# Altium schematic sheet 走线图2.SchDoc
size A3; PageSetup: Record=PageOptions|CenterHorizontal=True|CenterVertical=True|PrintScale=0.71|XCorrection=1.00|YCorrection=1.00|PrintKind=1|BorderSize=5000000|LeftOffset=0|BottomOffset=0|Orientation=2|PaperLength=1000|PaperWidth=1000|Scale=100|PaperSource=260|PrintQuality=600|MediaType=1|DitherType=10|PaperKind=A4|PrintScaleMode=1
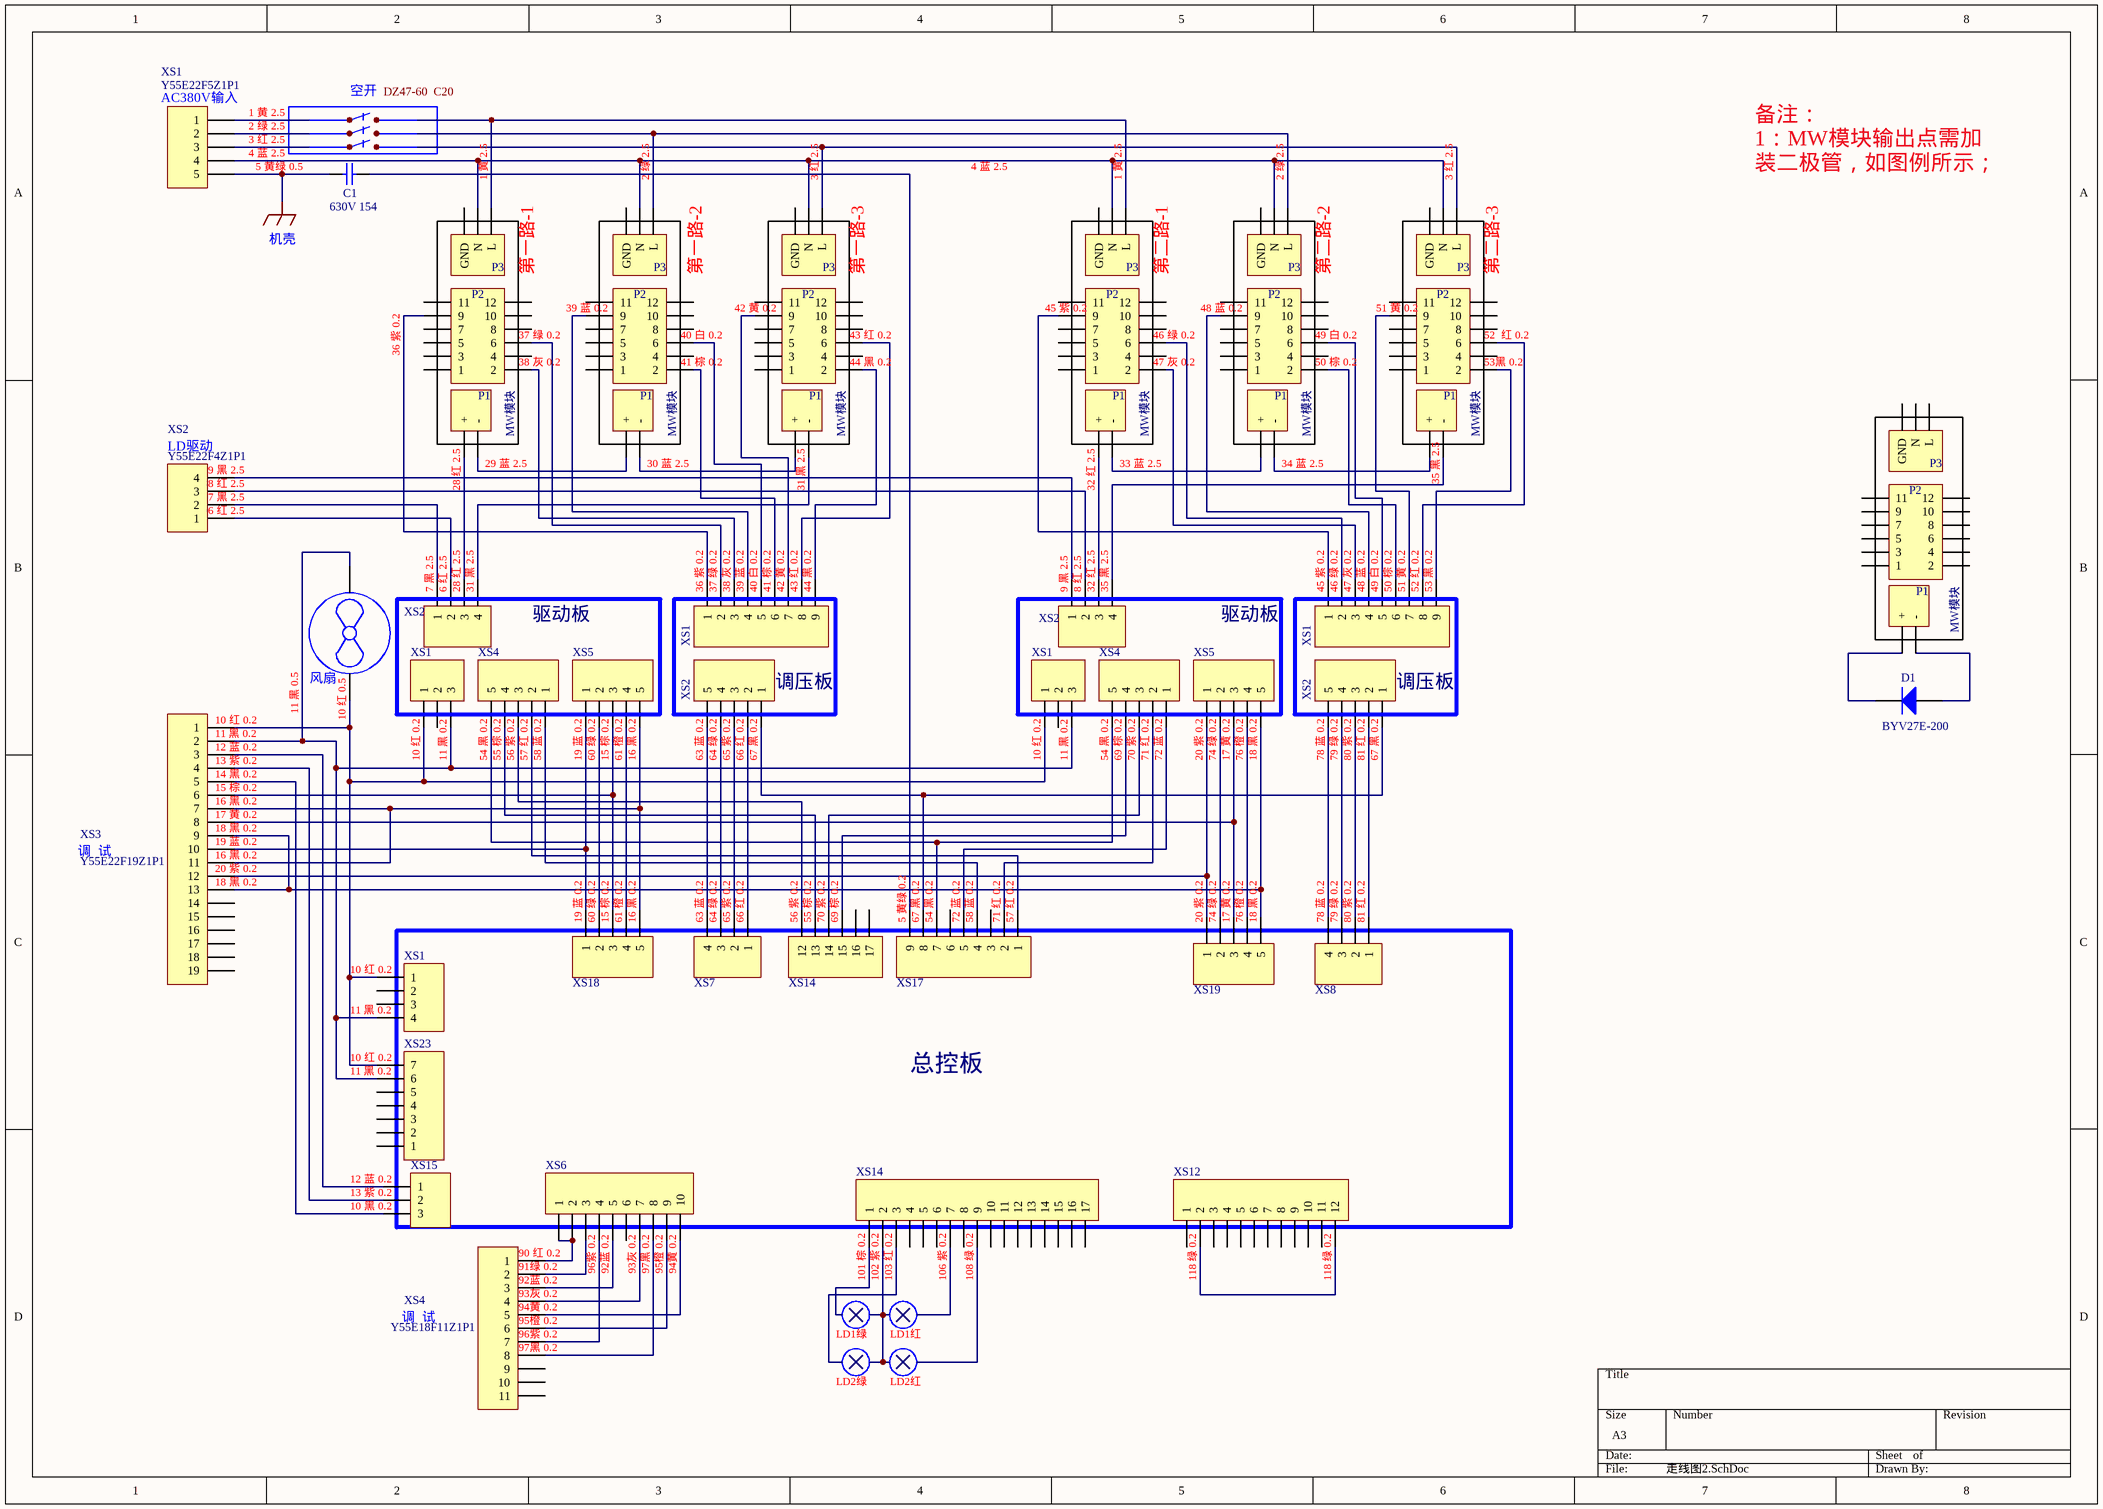
[diagram p0: 走线图2.SchDoc]

## Parts
(Parts that share a designator on the sheet are numbered #1, #2 ... from top to bottom, then left to right.)
?  (no value)
C1  value 630V 154  [RAD-0.3]  (hidden comment: Cap)
D1  BYV27E-200  [DIO18.84-9.6x5.6]
P1#1  Header 2  [HDR1X2]  (value not drawn)
P1#2  Header 2  [HDR1X2]  (value not drawn)
P1#3  Header 2  [HDR1X2]  (value not drawn)
P1#4  Header 2  [HDR1X2]  (value not drawn)
P1#5  Header 2  [HDR1X2]  (value not drawn)
P1#6  Header 2  [HDR1X2]  (value not drawn)
P1#7  Header 2  [HDR1X2]  (value not drawn)
P2#1  Header 6X2H  [HDR2X6H]  (value not drawn)
P2#2  Header 6X2H  [HDR2X6H]  (value not drawn)
P2#3  Header 6X2H  [HDR2X6H]  (value not drawn)
P2#4  Header 6X2H  [HDR2X6H]  (value not drawn)
P2#5  Header 6X2H  [HDR2X6H]  (value not drawn)
P2#6  Header 6X2H  [HDR2X6H]  (value not drawn)
P2#7  Header 6X2H  [HDR2X6H]  (value not drawn)
P3#1  Header 3  [HDR1X3]  (value not drawn)
P3#2  Header 3  [HDR1X3]  (value not drawn)
P3#3  Header 3  [HDR1X3]  (value not drawn)
P3#4  Header 3  [HDR1X3]  (value not drawn)
P3#5  Header 3  [HDR1X3]  (value not drawn)
P3#6  Header 3  [HDR1X3]  (value not drawn)
P3#7  Header 3  [HDR1X3]  (value not drawn)
XS1#1  Y55E22F5Z1P1  [HDR1X5]
XS1#2  Header 9  [HDR1X9]  (value not drawn)
XS1#3  Header 9  [HDR1X9]  (value not drawn)
XS1#4  Header 3  [HDR1X3]  (value not drawn)
XS1#5  Header 3  [HDR1X3]  (value not drawn)
XS1#6  Header 4  [HDR1X4]  (value not drawn)
XS2#1  Y55E22F4Z1P1  [HDR1X4]
XS2#2  Header 4  [HDR1X4]  (value not drawn)
XS2#3  Header 4  [HDR1X4]  (value not drawn)
XS2#4  Header 5  [HDR1X5]  (value not drawn)
XS2#5  Header 5  [HDR1X5]  (value not drawn)
XS3  Y55E22F19Z1P1  [HDR1X19]
XS4#1  Header 5  [HDR1X5]  (value not drawn)
XS4#2  Header 5  [HDR1X5]  (value not drawn)
XS4#3  Y55E18F11Z1P1  [HDR1X11]
XS5#1  Header 5  [HDR1X5]  (value not drawn)
XS5#2  Header 5  [HDR1X5]  (value not drawn)
XS6  Header 10  [HDR1X10]  (value not drawn)
XS7  Header 4  [HDR1X4]  (value not drawn)
XS8  Header 4  [HDR1X4]  (value not drawn)
XS12  Header 12  [HDR1X12]  (value not drawn)
XS14#1  Header 6  [HDR1X6]  (value not drawn)
XS14#2  Header 17  [HDR1X17]  (value not drawn)
XS15  Header 3  [HDR1X3]  (value not drawn)
XS17  Header 9  [HDR1X9]  (value not drawn)
XS18  Header 5  [HDR1X5]  (value not drawn)
XS19  Header 5  [HDR1X5]  (value not drawn)
XS23  Header 7  [HDR1X7]  (value not drawn)

## Blocks framed on the sheet
驱动板: XS1#4 XS2#2 XS4#1 XS5#1
调压板: XS1#2 XS2#4
驱动板: XS1#5 XS2#3 XS4#2 XS5#2
调压板: XS1#3 XS2#5
总控板: XS1#6 XS6-XS8 XS12 XS14#1 XS14#2 XS15 XS17-XS19 XS23

## Nets
VSS: C1.2 XS1#1.5
Net?_9: ?.9 XS1#4.3 XS1#5.3 XS1#6.4 XS3.2 XS23.6
Net?_10: ?.10 XS1#4.1 XS1#5.1 XS1#6.1 XS3.1 XS23.7
NetC1_1: C1.1 XS17.9
NetD1_1: D1.1(A) P1#7.2(-)
NetD1_2: D1.2(K) P1#7.1(+)
NetP1#1_1: P1#1.1(+) XS2#2.3
NetP1#1_2: P1#1.2(-) P1#2.1(+)
NetP1#2_2: P1#2.2(-) P1#3.1(+)
NetP1#3_2: P1#3.2(-) XS2#2.4
NetP1#4_1: P1#4.1(+) XS2#3.3
NetP1#4_2: P1#4.2(-) P1#5.1(+)
NetP1#5_2: P1#5.2(-) P1#6.1(+)
NetP1#6_2: P1#6.2(-) XS2#3.4
NetP2#1_2: P2#1.2 XS1#2.3
NetP2#1_6: P2#1.6 XS1#2.2
NetP2#1_9: P2#1.9 XS1#2.1
NetP2#2_2: P2#2.2 XS1#2.6
NetP2#2_6: P2#2.6 XS1#2.5
NetP2#2_9: P2#2.9 XS1#2.4
NetP2#3_2: P2#3.2 XS1#2.9
NetP2#3_6: P2#3.6 XS1#2.8
NetP2#3_9: P2#3.9 XS1#2.7
NetP2#4_2: P2#4.2 XS1#3.3
NetP2#4_6: P2#4.6 XS1#3.2
NetP2#4_9: P2#4.9 XS1#3.1
NetP2#5_2: P2#5.2 XS1#3.6
NetP2#5_6: P2#5.6 XS1#3.5
NetP2#5_9: P2#5.9 XS1#3.4
NetP2#6_2: P2#6.2 XS1#3.9
NetP2#6_6: P2#6.6 XS1#3.8
NetP2#6_9: P2#6.9 XS1#3.7
NetP3#1_1: P3#1.1(L) P3#4.1(L)
NetP3#1_2: P3#1.2(N) P3#2.2(N) P3#3.2(N) P3#4.2(N) P3#5.2(N) P3#6.2(N) XS1#1.4
NetP3#2_1: P3#2.1(L) P3#5.1(L)
NetP3#3_1: P3#3.1(L) P3#6.1(L)
NetXS2#1_1: XS2#1.1 XS2#2.2
NetXS2#1_2: XS2#1.2 XS2#2.1
NetXS2#1_3: XS2#1.3 XS2#3.2
NetXS2#1_4: XS2#1.4 XS2#3.1
NetXS2#4_1: XS2#4.1 XS2#5.1 XS17.8
NetXS2#4_2: XS2#4.2 XS7.1
NetXS2#4_3: XS2#4.3 XS7.2
NetXS2#4_4: XS2#4.4 XS7.3
NetXS2#4_5: XS2#4.5 XS7.4
NetXS2#5_2: XS2#5.2 XS8.1
NetXS2#5_3: XS2#5.3 XS8.2
NetXS2#5_4: XS2#5.4 XS8.3
NetXS2#5_5: XS2#5.5 XS8.4
NetXS3_3: XS3.3 XS15.1
NetXS3_4: XS3.4 XS15.2
NetXS3_5: XS3.5 XS15.3
NetXS3_6: XS3.6 XS5#1.3 XS18.3
NetXS3_7: XS3.7 XS3.11 XS5#1.5 XS18.5
NetXS3_8: XS3.8 XS5#2.3 XS19.3
NetXS3_9: XS3.9 XS3.13 XS5#2.5 XS19.5
NetXS3_10: XS3.10 XS5#1.1 XS18.1
NetXS3_12: XS3.12 XS5#2.1 XS19.1
NetXS4#1_1: XS4#1.1 XS17.4
NetXS4#1_2: XS4#1.2 XS17.1
NetXS4#1_3: XS4#1.3 XS14#1.1(12)
NetXS4#1_4: XS4#1.4 XS14#1.2(13)
NetXS4#1_5: XS4#1.5 XS4#2.5 XS17.7
NetXS4#2_1: XS4#2.1 XS17.5
NetXS4#2_2: XS4#2.2 XS17.2
NetXS4#2_3: XS4#2.3 XS14#1.3(14)
NetXS4#2_4: XS4#2.4 XS14#1.4(15)
NetXS4#3_1: XS4#3.1 XS6.1 XS6.2
NetXS4#3_2: XS4#3.2 XS6.3
NetXS4#3_3: XS4#3.3 XS6.5
NetXS4#3_4: XS4#3.4 XS6.7
NetXS4#3_5: XS4#3.5 XS6.10
NetXS4#3_6: XS4#3.6 XS6.9
NetXS4#3_7: XS4#3.7 XS6.4
NetXS4#3_8: XS4#3.8 XS6.8
NetXS5#1_2: XS5#1.2 XS18.2
NetXS5#1_4: XS5#1.4 XS18.4
NetXS5#2_2: XS5#2.2 XS19.2
NetXS5#2_4: XS5#2.4 XS19.4
NetXS12_2: XS12.2 XS12.12

Not connected (* = marked no-connect by the designer): P2#1 1 3 4 5 7 8 10 11 12; P2#2 1 3 4 5 7 8 10 11 12; P2#3 1 3 4 5 7 8 10 11 12; P2#4 1 3 4 5 7 8 10 11 12; P2#5 1 3 4 5 7 8 10 11 12; P2#6 1 3 4 5 7 8 10 11 12; P2#7 1 2 3 4 5 6 7 8 9 10 11 12; P3#1 3(GND); P3#2 3(GND); P3#3 3(GND); P3#4 3(GND); P3#5 3(GND); P3#6 3(GND); P3#7 1(L) 2(N) 3(GND); XS1#1 1 2 3; XS1#4 2; XS1#5 2; XS1#6 2 3; XS3 14 15 16 17 18 19; XS4#3 9 10 11; XS6 6; XS12 1 3 4 5 6 7 8 9 10 11; XS14#1 5(16) 6(17); XS14#2 1 2 3 4 5 6 7 8 9 10 11 12 13 14 15 16 17; XS17 3 6; XS23 1 2 3 4 5

## Notes on the sheet
- (near XS1#1) AC380V输入
- 空开
- (near XS1#1) 1 黄 2.5
- (near XS1#1) 2 绿 2.5
- (near XS1#1) 3 红 2.5
- (near XS1#1) 4 蓝 2.5
- (near XS1#1) 5 黄绿 0.5
- (near P3#1) 1 黄 2.5
- (near P3#2) 2 绿 2.5
- (near P3#3) 3 红 2.5
- 4 蓝 2.5
- (near P3#4) 1 黄 2.5
- (near P3#5) 2 绿 2.5
- (near P3#6) 3 红 2.5
- 机壳
- 第一路-1
- (near P2#2) 39 蓝 0.2
- 第一路-2
- (near P2#3) 42 黄 0.2
- 第一路-3
- (near P2#4) 45 紫 0.2
- 第二路-1
- (near P2#5) 48 蓝 0.2
- 第二路-2
- (near P2#6) 51 黄 0.2
- 第二路-3
- 备注：
  1：MW模块输出点需加装二极管，如图例所示；
- (near P2#1) 36 紫 0.2
- (near P2#1) 37 绿 0.2
- (near P2#1) 38 灰 0.2
- (near P2#2) 41 棕 0.2
- (near P2#2) 40 白 0.2
- (near P2#3) 43 红 0.2
- (near P2#3) 44 黑 0.2
- (near P2#4) 46 绿 0.2
- (near P2#4) 47 灰 0.2
- (near P2#5) 49 白 0.2
- (near P2#5) 50 棕 0.2
- (near P2#6) 52  红 0.2
- (near P2#6) 53黑 0.2
- (near XS2#1) LD驱动
- MW模块
- (near XS2#1) 6 红 2.5
- (near XS2#1) 7 黑 2.5
- (near XS2#1) 8 红 2.5
- (near XS2#1) 9 黑 2.5
- (near P1#1) 28 红 2.5
- (near P1#1) 29 蓝 2.5
- (near P1#2) 30 蓝 2.5
- (near P1#3) 31 黑 2.5
- (near P1#4) 32 红 2.5
- (near P1#4) 33 蓝 2.5
- (near P1#5) 34 蓝 2.5
- (near P1#6) 35 黑 2.5
- (near XS2#2) 7 黑 2.5
- (near XS2#2) 6 红 2.5
- (near XS2#2) 28 红 2.5
- (near XS2#2) 31 黑 2.5
- (near XS1#2) 36 紫 0.2
- (near XS1#2) 37 绿 0.2
- (near XS1#2) 38 灰 0.2
- (near XS1#2) 39 蓝 0.2
- (near XS1#2) 40 白 0.2
- (near XS1#2) 41 棕 0.2
- (near XS1#2) 42 黄 0.2
- (near XS1#2) 43 红 0.2
- (near XS1#2) 44 黑 0.2
- (near XS2#3) 9 黑 2.5
- (near XS2#3) 8 红 2.5
- (near XS2#3) 32 红 2.5
- (near XS2#3) 35 黑 2.5
- (near XS1#3) 45 紫 0.2
- (near XS1#3) 46 绿 0.2
- (near XS1#3) 47 灰 0.2
- (near XS1#3) 48 蓝 0.2
- (near XS1#3) 49 白 0.2
- (near XS1#3) 50 棕 0.2
- (near XS1#3) 51 黄 0.2
- (near XS1#3) 52 红 0.2
- (near XS1#3) 53 黑 0.2
- (near XS3) 10 红 0.2
- 11 黑 0.5
- 风扇
- 10 红 0.5
- (near XS3) 13 紫 0.2
- (near XS3) 12 蓝 0.2
- (near XS3) 11 黑 0.2
- (near XS3) 14 黑 0.2
- (near XS1#4) 10 红 0.2
- (near XS1#4) 11 黑 0.2
- (near XS4#1) 54 黑 0.2
- (near XS4#1) 55 棕 0.2
- (near XS4#1) 56 紫 0.2
- (near XS4#1) 57 红 0.2
- (near XS4#1) 58 蓝 0.2
- (near XS5#1) 19 蓝 0.2
- (near XS5#1) 60 绿 0.2
- (near XS5#1) 15 棕 0.2
- (near XS5#1) 61 橙 0.2
- (near XS5#1) 16 黑 0.2
- (near XS2#4) 63 蓝 0.2
- (near XS2#4) 64 绿 0.2
- (near XS2#4) 65 紫 0.2
- (near XS2#4) 66 红 0.2
- (near XS2#4) 67 黑 0.2
- (near XS1#5) 10 红 0.2
- (near XS1#5) 11 黑 0.2
- (near XS4#2) 54 黑 0.2
- (near XS4#2) 69 棕 0.2
- (near XS4#2) 70 紫 0.2
- (near XS4#2) 71 红 0.2
- (near XS4#2) 72 蓝 0.2
- (near XS5#2) 20 紫 0.2
- (near XS5#2) 74 绿 0.2
- (near XS5#2) 17 黄 0.2
- (near XS5#2) 76 橙 0.2
- (near XS5#2) 18 黑 0.2
- (near XS2#5) 78 蓝 0.2
- (near XS2#5) 79 绿 0.2
- (near XS2#5) 80 紫 0.2
- (near XS2#5) 81 红 0.2
- (near XS2#5) 67 黑 0.2
- 调  试
- (near XS3) 17 黄 0.2
- (near XS3) 16 黑 0.2
- (near XS3) 15 棕 0.2
- (near XS3) 19 蓝 0.2
- (near XS3) 18 黑 0.2
- (near XS3) 20 紫 0.2
- (near XS18) 19 蓝 0.2
- (near XS18) 60 绿 0.2
- (near XS18) 15 棕 0.2
- (near XS18) 61 橙 0.2
- (near XS18) 16 黑 0.2
- (near XS7) 63 蓝 0.2
- (near XS7) 64 绿 0.2
- (near XS7) 65 紫 0.2
- (near XS7) 66 红 0.2
- (near XS14#1) 56 紫 0.2
- (near XS14#1) 55 棕 0.2
- (near XS14#1) 70 紫 0.2
- (near XS14#1) 69 棕 0.2
- (near XS17) 5 黄绿 0.2
- (near XS17) 67 黑 0.2
- (near XS17) 54 黑 0.2
- (near XS17) 72 蓝 0.2
- (near XS17) 58 蓝 0.2
- (near XS17) 71 红 0.2
- (near XS17) 57 红 0.2
- (near XS19) 20 紫 0.2
- (near XS19) 74 绿 0.2
- (near XS19) 17 黄 0.2
- (near XS19) 76 橙 0.2
- (near XS19) 18 黑 0.2
- (near XS8) 78 蓝 0.2
- (near XS8) 79 绿 0.2
- (near XS8) 80 紫 0.2
- (near XS8) 81 红 0.2
- (near XS1#6) 10 红 0.2
- (near XS1#6) 11 黑 0.2
- (near XS23) 11 黑 0.2
- (near XS23) 10 红 0.2
- (near XS15) 12 蓝 0.2
- (near XS15) 13 紫 0.2
- (near XS15) 10 黑 0.2
- (near XS4#3) 90 红 0.2
- (near XS4#3) 91绿 0.2
- (near XS4#3) 92蓝 0.2
- (near XS4#3) 93灰 0.2
- (near XS4#3) 94黄 0.2
- (near XS4#3) 95橙 0.2
- (near XS6) 96紫 0.2
- (near XS6) 92蓝 0.2
- (near XS6) 93灰 0.2
- (near XS6) 97黑 0.2
- (near XS6) 95橙 0.2
- (near XS6) 94黄 0.2
- (near XS14#2) 101 棕 0.2
- (near XS14#2) 102 紫 0.2
- (near XS14#2) 103 红 0.2
- (near XS14#2) 106 紫 0.2
- (near XS14#2) 108 绿 0.2
- (near XS12) 118 绿 0.2
- (near XS4#3) 96紫 0.2
- (near XS4#3) 97黑 0.2
- LD1绿
- LD2绿
- LD1红
- LD2红
- Labels drawn without touching a wire or pin: DZ47-60  C20

## Library data of the parts
? = FAN1
C1 = Cap: Capacitor; Published: 8-Jun-2000; LatestRevisionDate: 17-Jul-2002; LatestRevisionNote: Re-released for DXP Platform.; PackageReference: RAD-0.3; Publisher: Altium Limited
D1 = Diode 1N5407: 3 Amp Medium Power Silicon Rectifier Diode; Published: 8-Jun-2000; LatestRevisionDate: 17-Jul-2002; LatestRevisionNote: Re-released for DXP Platform.; DatasheetVersion: Aug-1984; PackageReference: DO-201AD; Publisher: Altium Limited; ComponentLink1Description: Manufacturer Link; ComponentLink1URL: http://www.irf.com/
P1#1-P1#7 = Header 2: Header, 2-Pin; LatestRevisionDate: 17-Jul-2002; LatestRevisionNote: Re-released for DXP Platform.; Publisher: Altium Limited
P2#1-P2#7 = Header 6X2H: Header, 6-Pin, Dual row, Right Angle; LatestRevisionDate: 17-Jul-2002; LatestRevisionNote: Re-released for DXP Platform.; Publisher: Altium Limited
P3#1-P3#7 XS1#4 XS1#5 XS15 = Header 3: Header, 3-Pin; LatestRevisionDate: 17-Jul-2002; LatestRevisionNote: Re-released for DXP Platform.; Publisher: Altium Limited
XS1#1 XS2#4 XS2#5 XS4#1 XS4#2 XS5#1 XS5#2 XS18 XS19 = Header 5: Header, 5-Pin; LatestRevisionDate: 17-Jul-2002; LatestRevisionNote: Re-released for DXP Platform.; Publisher: Altium Limited
XS1#2 XS1#3 XS17 = Header 9: Header, 9-Pin; LatestRevisionDate: 17-Jul-2002; LatestRevisionNote: Re-released for DXP Platform.; Publisher: Altium Limited
XS1#6 XS2#1-XS2#3 XS7 XS8 = Header 4: Header, 4-Pin; LatestRevisionDate: 17-Jul-2002; LatestRevisionNote: Re-released for DXP Platform.; Publisher: Altium Limited
XS3 = Header 19: Header, 19-Pin; LatestRevisionDate: 17-Jul-2002; LatestRevisionNote: Re-released for DXP Platform.; Publisher: Altium Limited
XS4#3 = Header 11: Header, 11-Pin; LatestRevisionDate: 17-Jul-2002; LatestRevisionNote: Re-released for DXP Platform.; Publisher: Altium Limited
XS6 = Header 10: Header, 10-Pin; LatestRevisionDate: 17-Jul-2002; LatestRevisionNote: Re-released for DXP Platform.; Publisher: Altium Limited
XS12 = Header 12: Header, 12-Pin; LatestRevisionDate: 17-Jul-2002; LatestRevisionNote: Re-released for DXP Platform.; Publisher: Altium Limited
XS14#1 = Header 6: Header, 6-Pin; LatestRevisionDate: 17-Jul-2002; LatestRevisionNote: Re-released for DXP Platform.; Publisher: Altium Limited
XS14#2 = Header 17: Header, 17-Pin; LatestRevisionDate: 17-Jul-2002; LatestRevisionNote: Re-released for DXP Platform.; Publisher: Altium Limited
XS23 = Header 7: Header, 7-Pin; LatestRevisionDate: 17-Jul-2002; LatestRevisionNote: Re-released for DXP Platform.; Publisher: Altium Limited